# EasyEDA Pro project MK_IR_I2C.epro

# Schematic MK_IR_I2C

## Sheets
1 P1: Board Name: IR_MUX; Create Date: 2025-06-09; Page Name: P1; Project Name: New-Car; Schematic Name: Schematic2; Update Date: 2025-06-10; Company: monkey-cat.com; Drawn: MonkeyCat; Page Size: A4; Part Number: JLCPCB-002; Reviewed: MonkeyCat; Version: V0.1.0
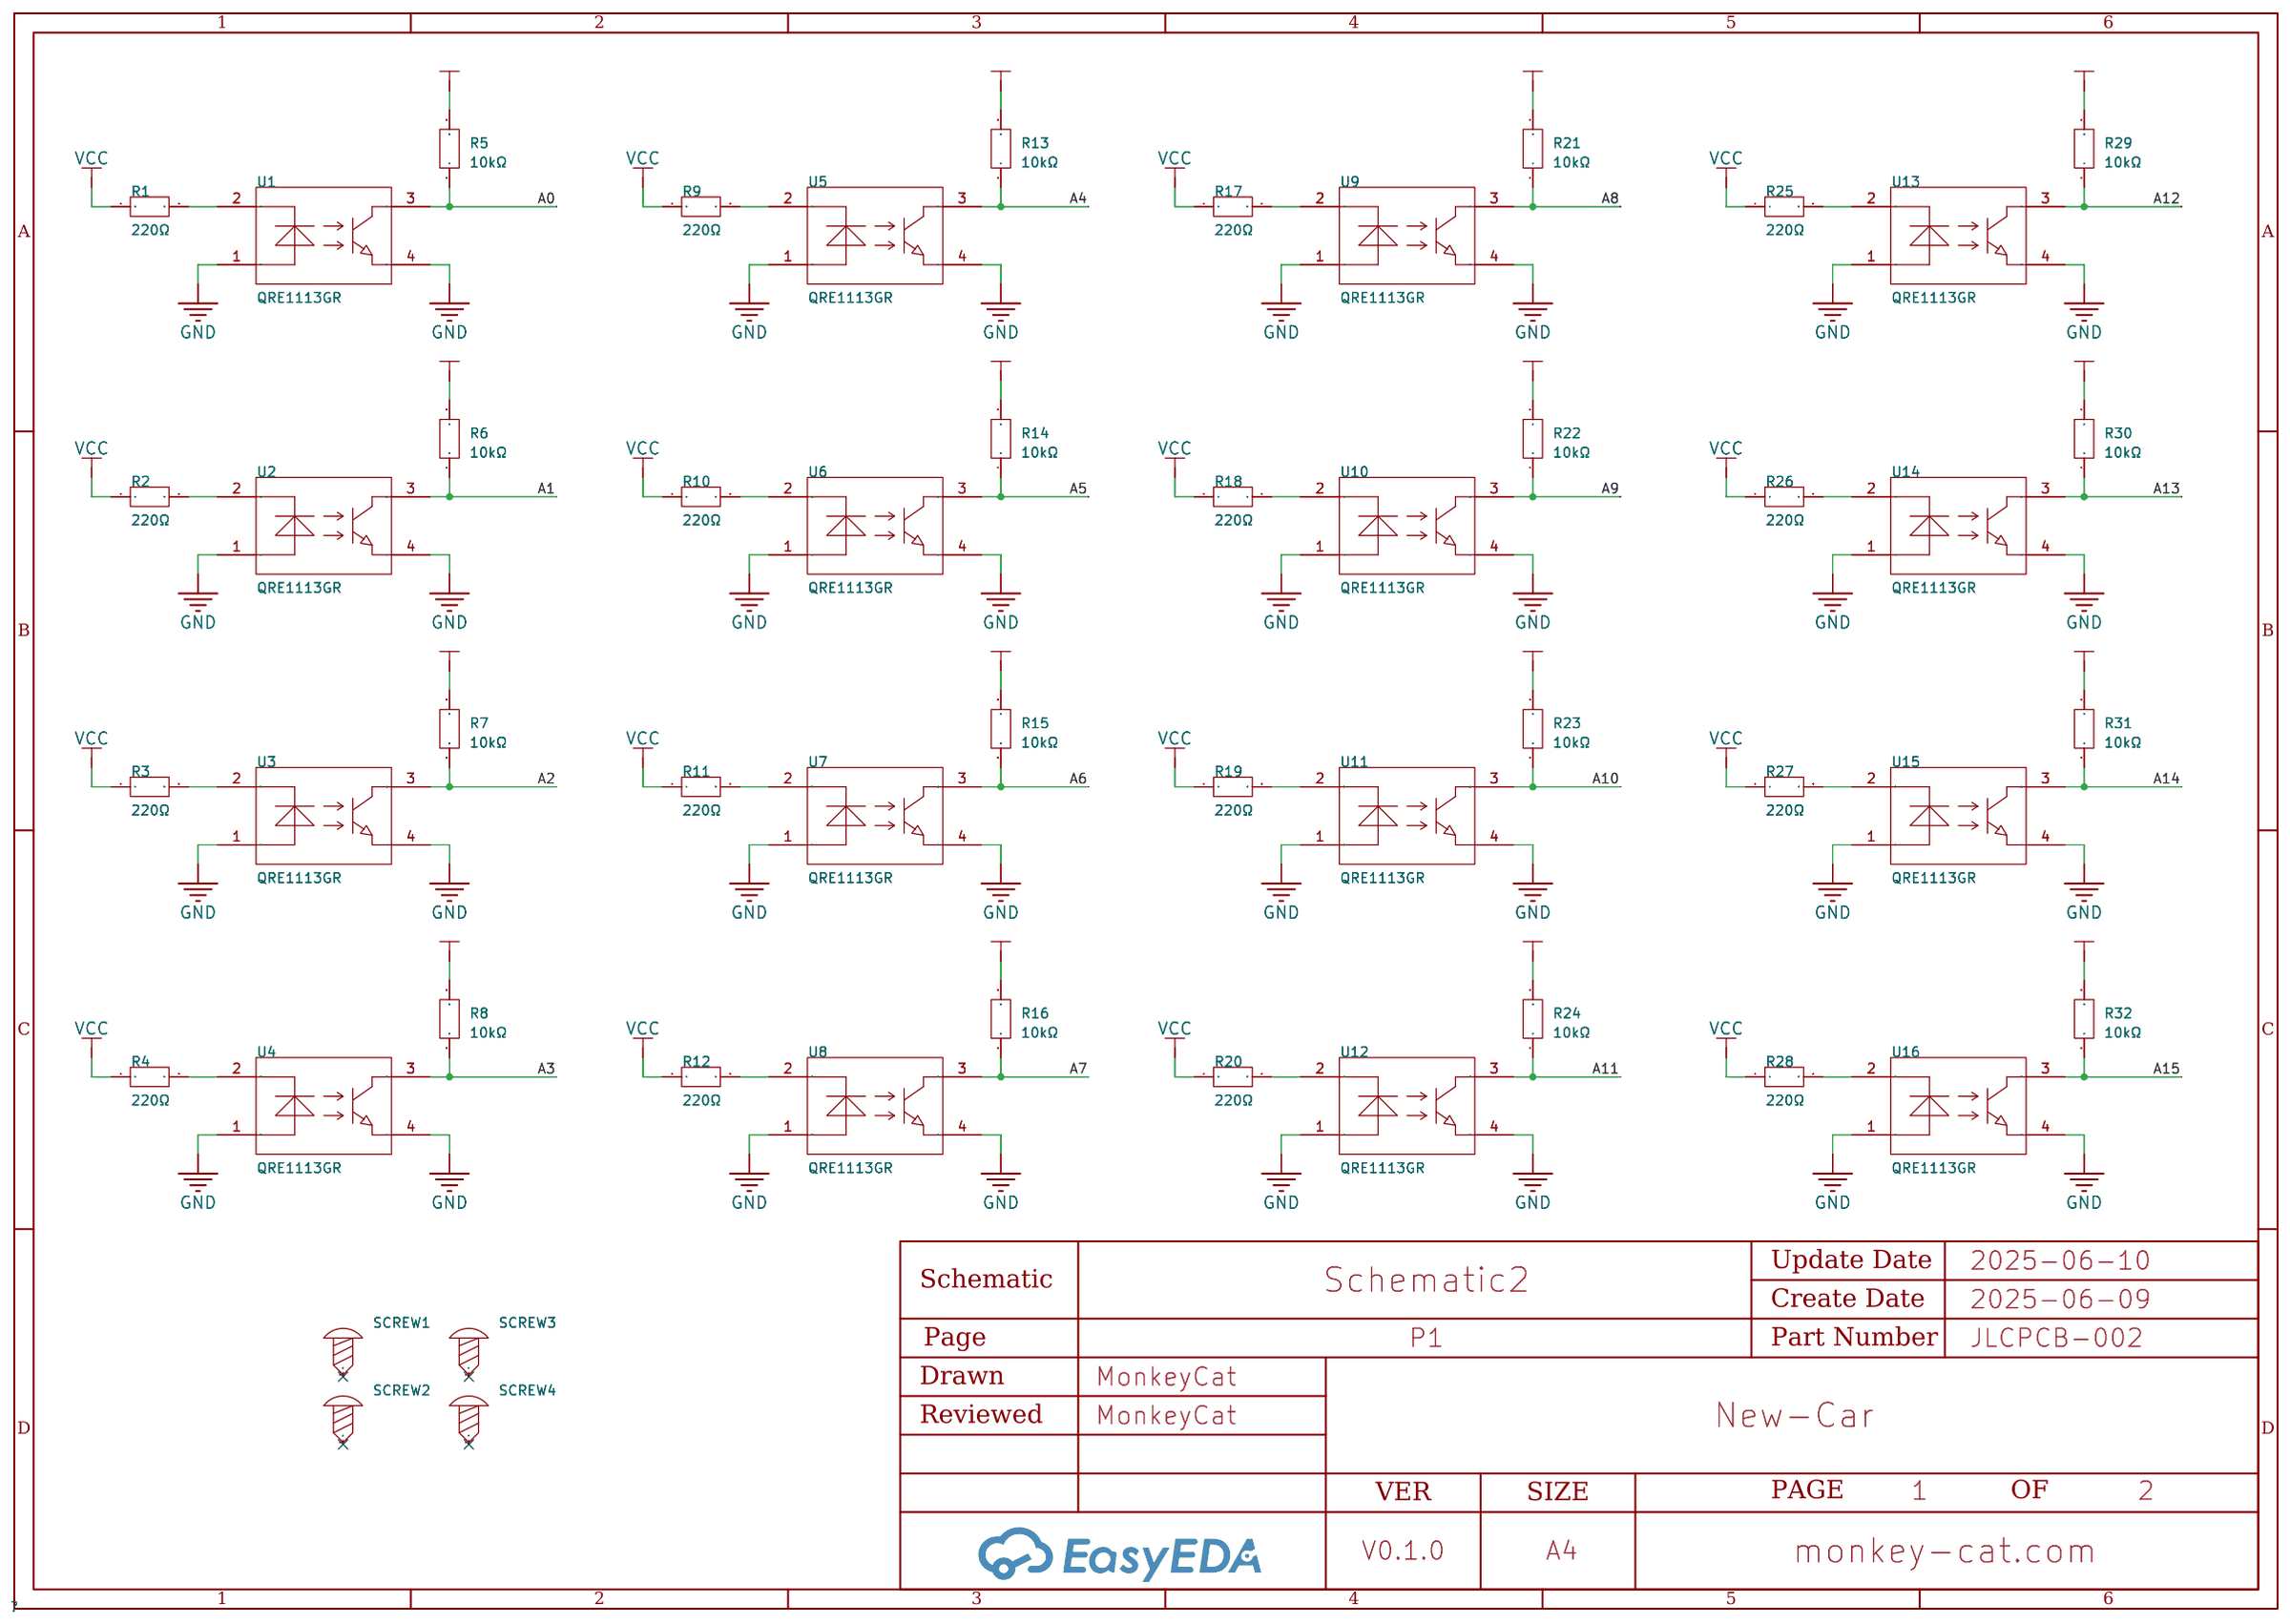
[diagram p0: P1]
2 P2: Board Name: MK_IR_I2C; Page Name: P2; Schematic Name: MK_IR_I2C; Update Date: 2025-06-11
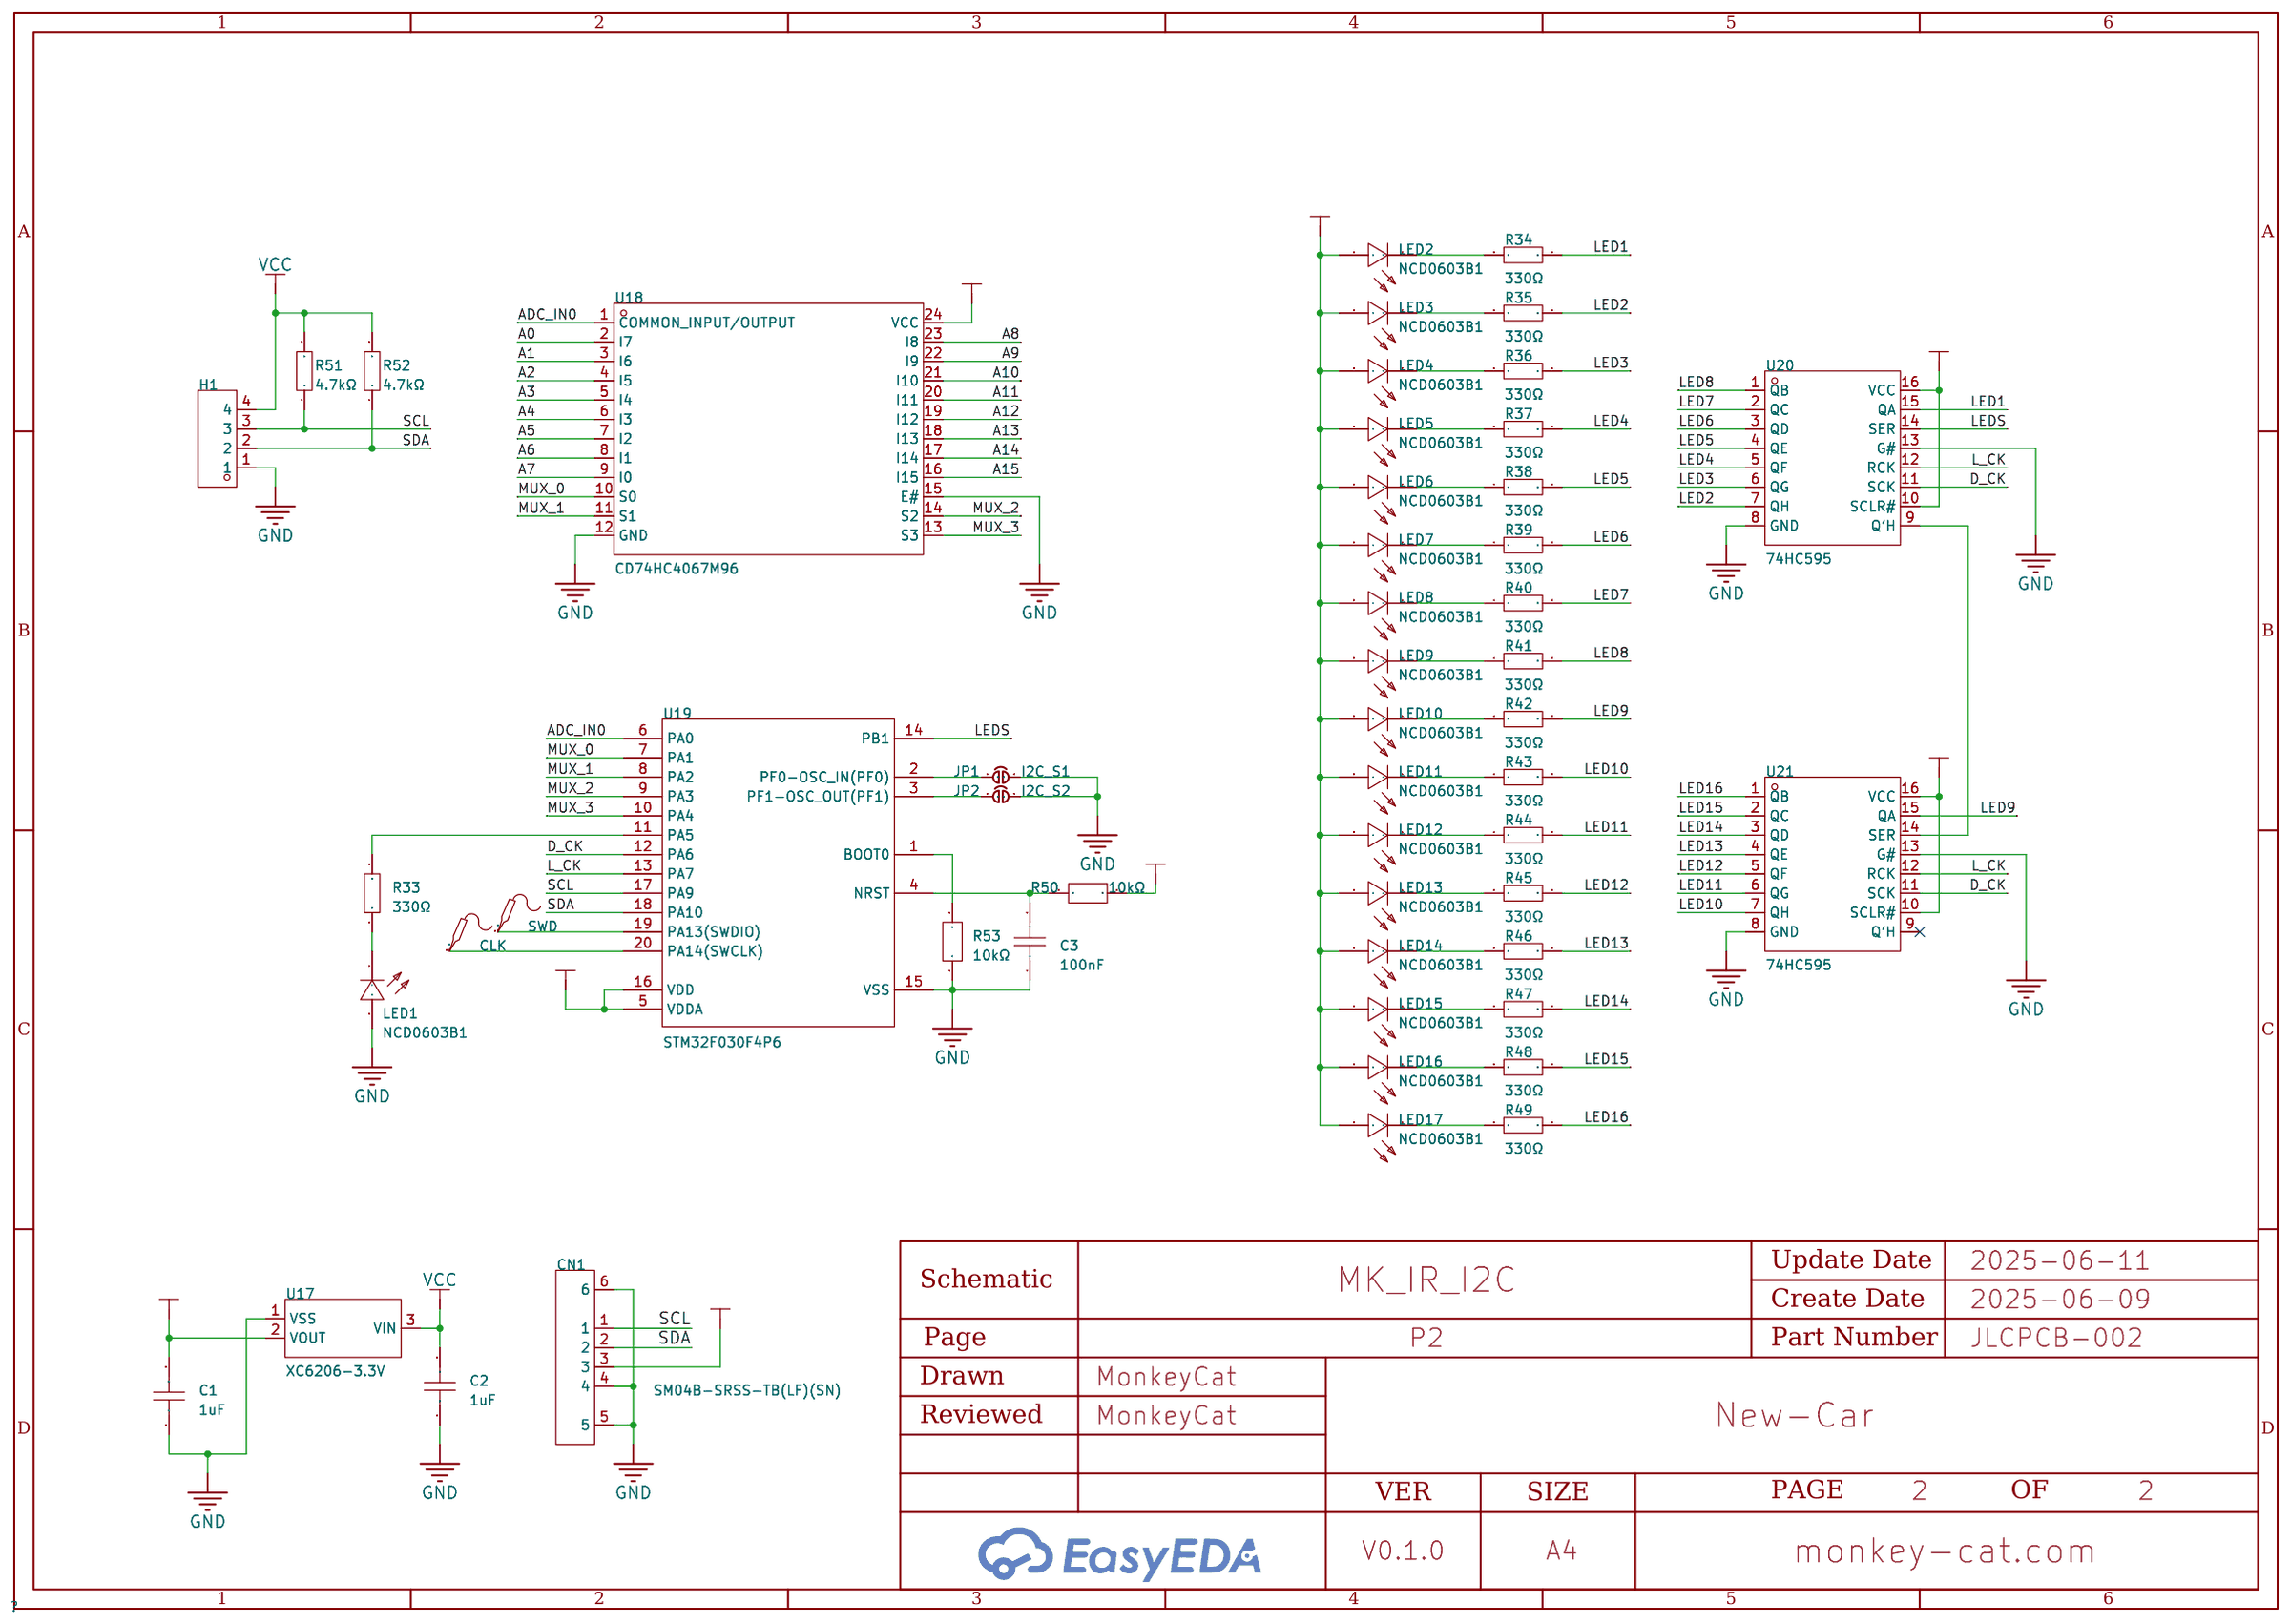
[diagram p1: P2]

## Parts
sheet P1
R1  220Ω  [R0603]
R2  220Ω  [R0603]
R3  220Ω  [R0603]
R4  220Ω  [R0603]
R5  10kΩ  [R0603]
R6  10kΩ  [R0603]
R7  10kΩ  [R0603]
R8  10kΩ  [R0603]
R9  220Ω  [R0603]
R10  220Ω  [R0603]
R11  220Ω  [R0603]
R12  220Ω  [R0603]
R13  10kΩ  [R0603]
R14  10kΩ  [R0603]
R15  10kΩ  [R0603]
R16  10kΩ  [R0603]
R17  220Ω  [R0603]
R18  220Ω  [R0603]
R19  220Ω  [R0603]
R20  220Ω  [R0603]
R21  10kΩ  [R0603]
R22  10kΩ  [R0603]
R23  10kΩ  [R0603]
R24  10kΩ  [R0603]
R25  220Ω  [R0603]
R26  220Ω  [R0603]
R27  220Ω  [R0603]
R28  220Ω  [R0603]
R29  10kΩ  [R0603]
R30  10kΩ  [R0603]
R31  10kΩ  [R0603]
R32  10kΩ  [R0603]
SCREW1  -  [Screw-Hole-M3]
SCREW2  -  [Screw-Hole-M3]
SCREW3  -  [Screw-Hole-M3]
SCREW4  -  [Screw-Hole-M3]
U1  QRE1113GR  [OPTO-SMD_QRE1113GR]
U2  QRE1113GR  [OPTO-SMD_QRE1113GR]
U3  QRE1113GR  [OPTO-SMD_QRE1113GR]
U4  QRE1113GR  [OPTO-SMD_QRE1113GR]
U5  QRE1113GR  [OPTO-SMD_QRE1113GR]
U6  QRE1113GR  [OPTO-SMD_QRE1113GR]
U7  QRE1113GR  [OPTO-SMD_QRE1113GR]
U8  QRE1113GR  [OPTO-SMD_QRE1113GR]
U9  QRE1113GR  [OPTO-SMD_QRE1113GR]
U10  QRE1113GR  [OPTO-SMD_QRE1113GR]
U11  QRE1113GR  [OPTO-SMD_QRE1113GR]
U12  QRE1113GR  [OPTO-SMD_QRE1113GR]
U13  QRE1113GR  [OPTO-SMD_QRE1113GR]
U14  QRE1113GR  [OPTO-SMD_QRE1113GR]
U15  QRE1113GR  [OPTO-SMD_QRE1113GR]
U16  QRE1113GR  [OPTO-SMD_QRE1113GR]
sheet P2
C1  1uF  [C0603]
C2  1uF  [C0603]
C3  100nF  [C0603]
CLK  -  [Test-Point-0.5mm]
CN1  SM04B-SRSS-TB(LF)(SN)  [CONN-SMD_4P-P1.00_SM04B-SRSS-TB-LF-SN]
H1  -  [HDR-TH_4P-P2.54-V-M]
JP1  I2C_S1  [SOLDER JUMPER]
JP2  I2C_S2  [SOLDER JUMPER]
LED1  NCD0603B1  [LED0603-RD]
LED2  NCD0603B1  [LED0603-RD]
LED3  NCD0603B1  [LED0603-RD]
LED4  NCD0603B1  [LED0603-RD]
LED5  NCD0603B1  [LED0603-RD]
LED6  NCD0603B1  [LED0603-RD]
LED7  NCD0603B1  [LED0603-RD]
LED8  NCD0603B1  [LED0603-RD]
LED9  NCD0603B1  [LED0603-RD]
LED10  NCD0603B1  [LED0603-RD]
LED11  NCD0603B1  [LED0603-RD]
LED12  NCD0603B1  [LED0603-RD]
LED13  NCD0603B1  [LED0603-RD]
LED14  NCD0603B1  [LED0603-RD]
LED15  NCD0603B1  [LED0603-RD]
LED16  NCD0603B1  [LED0603-RD]
LED17  NCD0603B1  [LED0603-RD]
R33  330Ω  [R0603]
R34  330Ω  [R0603]
R35  330Ω  [R0603]
R36  330Ω  [R0603]
R37  330Ω  [R0603]
R38  330Ω  [R0603]
R39  330Ω  [R0603]
R40  330Ω  [R0603]
R41  330Ω  [R0603]
R42  330Ω  [R0603]
R43  330Ω  [R0603]
R44  330Ω  [R0603]
R45  330Ω  [R0603]
R46  330Ω  [R0603]
R47  330Ω  [R0603]
R48  330Ω  [R0603]
R49  330Ω  [R0603]
R50  10kΩ  [R0603]
R51  4.7kΩ  [R0603]
R52  4.7kΩ  [R0603]
R53  10kΩ  [R0603]
SWD  -  [Test-Point-0.5mm]
U17  XC6206-3.3V  [SOT-23-3_L2.9-W1.3-P0.95-LS2.4-BR]
U18  CD74HC4067M96  [SOIC-24_L15.4-W7.5-P1.27-LS10.3-BL]
U19  STM32F030F4P6  [TSSOP-20_L6.5-W4.4-P0.65-LS6.4-BL]
U20  74HC595  [SOP-16_L9.9-W3.9-P1.27-LS6.0-BL]
U21  74HC595  [SOP-16_L9.9-W3.9-P1.27-LS6.0-BL]

## Library data of the parts
R1-R4 R9-R12 R17-R20 R25-R28 = FRC0603F2200TS: Type:Thick Film Resistors Resistance: Tolerance:±1% Tolerance:±1% Power(Watts): Voltage-Supply(Max): Temperature Coefficient:±100ppm/℃ Temperature Coefficient:±100ppm/℃ Operating Temperature:-55℃~+155℃ Operating Temperature:-55℃~+155℃; LCSC Part Name: 220Ω ±1% 100mW 厚膜电阻; Supplier Part: C2907014; Manufacturer: FOJAN(富捷); Supplier Footprint: 0603; JLCPCB Part Class: 扩展库; Datasheet: https://atta.szlcsc.com/upload/public/pdf/source/20211221/925EC7D7225764EE0046F22065062C87.pdf; Supplier: LCSC; Type: Thick Film Resistors; Tolerance: ±1%; Temperature Coefficient: ±100ppm/℃; Operating Temperature: -55℃~+155℃
R5-R8 R13-R16 R21-R24 R29-R32 R50 R53 = FRC0603J103 TS: Type:Thick Film Resistors Resistance:10kΩ Tolerance:±5% Tolerance:±5% Power(Watts):0.1W Voltage-Supply(Max):75V Temperature Coefficient:±100ppm/℃ Temperature Coefficient:±100ppm/℃ Operating Temperature:-55℃~+155℃ Operating Temperature:-55℃~+155℃; LCSC Part Name: 10kΩ ±5% 100mW 厚膜电阻; Supplier Part: C2930027; Manufacturer: FOJAN(富捷); Supplier Footprint: 0603; JLCPCB Part Class: 扩展库; Datasheet: https://atta.szlcsc.com/upload/public/pdf/source/20211221/925EC7D7225764EE0046F22065062C87.pdf; Supplier: LCSC; Type: Thick Film Resistors; Tolerance: ±5%; Power(Watts): 0.1W; Voltage-Supply(Max): 75V; Temperature Coefficient: ±100ppm/℃; Operating Temperature: -55℃~+155℃
SCREW1-SCREW4 = Screw-Hole-M3: Supplier Footprint: 插件
U1-U16 = QRE1113GR: Sensing Distance:1mm Collector Current (Max):20mA; Supplier Part: C232862; Manufacturer: onsemi(安森美); Supplier Footprint: SMD-4P; JLCPCB Part Class: 扩展库; Datasheet: https://atta.szlcsc.com/upload/public/pdf/source/20221020/4EA8EB874547A092CF9AAECC2DF94CC1.pdf; Supplier: LCSC; Sensing Distance: 1mm; Collector Current (Max): 20mA; Check: false
C1 C2 = CL10A105KB8NNNC: Capacitance: Tolerance:±10% Tolerance:±10% Voltage Rated: Temperature Coefficient:; LCSC Part Name: 1uF ±10% 50V; Supplier Part: C15849; Manufacturer: SAMSUNG(三星); Supplier Footprint: 0603; JLCPCB Part Class: 基础库; Datasheet: https://atta.szlcsc.com/upload/public/pdf/source/20160218/1457707763339.pdf; Supplier: LCSC; Tolerance: ±10%
C3 = CC0603KRX7R9BB104: Capacitance: Tolerance:±10% Tolerance:±10% Voltage Rated: Temperature Coefficient:; LCSC Part Name: 100nF ±10% 50V; Supplier Part: C14663; Manufacturer: YAGEO(国巨); Supplier Footprint: 0603; JLCPCB Part Class: 基础库; Datasheet: https://atta.szlcsc.com/upload/public/pdf/source/20180910/C282072_33301C7F631E79921B82A8DAC6BCC5B3.pdf; Supplier: LCSC; Tolerance: ±10%
CLK SWD = Test-Point: Test Point 测试点
CN1 = SM04B-SRSS-TB(LF)(SN): Pins Structure:1x4P Pitch:1mm Mounting Style:卧贴 Reference Series:SH Number of Pins:4P Number of Rows:1 Number of PINs Per Row:4 Row Spacing:- Current Rating (Max):1A Contact Material:Copper Alloy Contact Plating:Tin Operating Temperature Range:-25℃~+85℃ O; LCSC Part Name: 1x4P 间距:1mm 卧贴 系列:SH; Supplier Part: C160404; Manufacturer: JST; Supplier Footprint: SMD,P=1mm,卧贴; JLCPCB Part Class: 扩展库; Datasheet: https://atta.szlcsc.com/upload/public/pdf/source/20181010/C265335_7D2AD766CA0E20E745663C87507A223E.pdf; Supplier: LCSC; Pins Structure: 1x4P; Pitch: 1mm; Mounting Style: 卧贴; Reference Series: SH; Number of Pins: 4P; Number of Rows: 1; Number of PINs Per Row: 4; Current Rating (Max): 1A; Contact Material: Copper Alloy; Contact Plating: Tin; Operating Temperature Range: -25℃~+85℃; Rated Voltage (Max): 50V; Plastic Material: PA; Flame Retardant Rating: UL94V-0; Supplementary Features: 辅助焊脚; Colour: White; Z-Height of the Board: 2.9mm; X-Length of Bottom Edge on Board (Spacing Line): 6mm; Y-Width of Bottom Edge on Board: 4.32mm
H1 = HDR-M_2.54_1x4P: Supplier Footprint: Through
JP1 JP2 = Solder Jumper: Manufacturer: N/A; Manufacturer Part: N/A; Supplier: Steve Manley; Supplier Part: N/A; link: N/A
LED1-LED17 = NCD0603B1: Lamp Holder Type:- Illumination Color:- Voltage - Forward(Vf):2.6V~3.6V Voltage - Forward(Vf):2.6V~3.6V Power(Watts):72mW Forward Current:10mA Wavelength - Dominant:463nm~475nm Wavelength - Dominant:463nm~475nm Peak Wavelength:- Diode Configuration:- Lens; Supplier Part: C84266; Manufacturer: 国星光电; Supplier Footprint: 0603; JLCPCB Part Class: 扩展库; Datasheet: https://atta.szlcsc.com/upload/public/pdf/source/20200820/C84266_6A3CDBEFA72C6CAD68EDA53474ADAE6C.pdf; Supplier: LCSC; Voltage - Forward(Vf): 2.6V~3.6V; Power(Watts): 72mW; Forward Current: 10mA; Wavelength - Dominant: 463nm~475nm; Luminous Intensity: 80mcd~220mcd; Viewing Angle: 130°; Operating Temperature: -30℃~+85℃
R33-R49 = 0603WAF3300T5E: Type:Thick Film Resistors Resistance: Tolerance:±1% Tolerance:±1% Power(Watts): Overload Voltage (Max): Temperature Coefficient:±100ppm/℃ Temperature Coefficient:±100ppm/℃ Operating Temperature Range:-55℃~+155℃ Operating Temperature Range:-55℃~+155℃; LCSC Part Name: 330Ω ±1% 100mW 厚膜电阻; Supplier Part: C23138; Manufacturer: UNI-ROYAL(厚声); Supplier Footprint: 0603; JLCPCB Part Class: 基础库; Datasheet: https://atta.szlcsc.com/upload/public/pdf/source/20200306/C422600_1E6D84923E4A46A82E41ADD87F860B5C.pdf; Supplier: LCSC; Type: Thick Film Resistors; Tolerance: ±1%; Temperature Coefficient: ±100ppm/℃; Operating Temperature Range: -55℃~+155℃
R51 R52 = RC0603FR-074K7L: Type:Thick Film Resistors Resistance: Tolerance:±1% Tolerance:±1% Power(Watts): Overload Voltage (Max): Temperature Coefficient:±100ppm/℃ Temperature Coefficient:±100ppm/℃ Operating Temperature Range:-55℃~+155℃ Operating Temperature Range:-55℃~+155℃; LCSC Part Name: 厚膜电阻 4.7kΩ ±1% 100mW; Supplier Part: C99782; Manufacturer: YAGEO(国巨); Supplier Footprint: 0603; JLCPCB Part Class: 扩展库; Datasheet: https://atta.szlcsc.com/upload/public/pdf/source/20180224/C181757_15194369480721363983.pdf; Supplier: LCSC; Type: Thick Film Resistors; Tolerance: ±1%; Temperature Coefficient: ±100ppm/℃; Operating Temperature Range: -55℃~+155℃
U17 = XC6206-3.3V: Output Type:Fixed Voltage - Supply:6V Output Voltage:3.3V Output Voltage:3.3V Output Current:250mA Voltage Dropout:- standby current:- Features:Short-Circuit  Protection；Low ESR；Overcurrent Protection Operating Temperature:-40℃~+85℃@(Tj) Operating Tempera; LCSC Part Name: 输入6V 输出3.3V 250mA; Supplier Part: C3015484; Manufacturer: YONGYUTAI(永裕泰); Supplier Footprint: SOT-23; JLCPCB Part Class: 扩展库; Datasheet: https://atta.szlcsc.com/upload/public/pdf/source/20220516/96806819DEDB4F91BFC22B730F045FD3.pdf; Supplier: LCSC; Output Type: Fixed; Voltage - Supply: 6V; Output Voltage: 3.3V; Output Current: 250mA; Features: Short-Circuit  Protection；Low ESR；Overcurrent Protection; Operating Temperature: -40℃~+85℃@(Tj); Output Configuration: Positive electrode; Number of Outputs: 1
U18 = CD74HC4067M96: Switch Circuit:- Number of Channels:- Voltage - Supply:2V~6V Voltage - Supply:2V~6V Turn-on time:83ns RDS(on):200Ω Turn-off time:83ns Operating Temperature:-55℃~+125℃ Operating Temperature:-55℃~+125℃; LCSC Part Name: 高速CMOS逻辑16通道模拟多路复用器/解复用器; Supplier Part: C496123; Manufacturer: TI(德州仪器); Supplier Footprint: SOIC-24-300mil; JLCPCB Part Class: 扩展库; Datasheet: https://www.ti.com/cn/lit/gpn/cd74hc4067; Supplier: LCSC; Voltage - Supply: 2V~6V; Turn-on time: 83ns; RDS(on): 200Ω; Turn-off time: 83ns; Operating Temperature: -55℃~+125℃
U19 = STM32F030F4P6: CPU Core:ARM-M0 CPU Maximum Speed:48MHz Program Storage Size:16KB Program Memory Type:FLASH Number of I/O:15 ADC (Bit):12bit Voltage - Supply:2.4V~3.6V Voltage - Supply:2.4V~3.6V Applications:-; LCSC Part Name: 主流ARM Cortex-M0超值系列MCU，具有16 KB Flash和48 MHz CPU; Supplier Part: C32908; Manufacturer: ST(意法半导体); Supplier Footprint: TSSOP-20; JLCPCB Part Class: 扩展库; Datasheet: https://atta.szlcsc.com/upload/public/pdf/source/20150124/1457707258011.pdf; Supplier: LCSC; CPU Core: ARM-M0; CPU Maximum Speed: 48MHz; Program Storage Size: 16KB; Program Memory Type: FLASH; Number of I/O: 15; ADC (Bit): 12bit; Voltage - Supply: 2.4V~3.6V
U20 U21 = 74HC595: Function:串行至串行或并行 Supply Voltage:2V~6V Supply Voltage:2V~6V Number of Elements:1 Number of Bits per Element:8 Output Type:Tri-State Series: Operating Temperature:-40℃~+85℃ Operating Temperature:-40℃~+85℃; Supplier Part: C18164493; Manufacturer: GR(国睿); Supplier Footprint: SOP-16; JLCPCB Part Class: 扩展库; Datasheet: https://atta.szlcsc.com/upload/public/pdf/source/20230915/F264A7C02E418D1689E15579DAA93EB8.pdf; Supplier: LCSC; Function: 串行至串行或并行; Supply Voltage: 2V~6V; Number of Elements: 1; Number of Bits per Element: 8; Output Type: Tri-State; Operating Temperature: -40℃~+85℃

## Nets
+3V3: C1.2 LED2.2(+) LED3.2(+) LED4.2(+) LED5.2(+) LED6.2(+) LED7.2(+) LED8.2(+) LED9.2(+) LED10.2(+) LED11.2(+) LED12.2(+) LED13.2(+) LED14.2(+) LED15.2(+) LED16.2(+) LED17.2(+) R5.2 R6.2 R7.2 R8.2 R13.2 R14.2 R15.2 R16.2 R21.2 R22.2 R23.2 R24.2 R29.2 R30.2 R31.2 R32.2 R50.2 U17.2(VOUT) U18.24(VCC) U19.5(VDDA) U19.16(VDD) U20.10(SCLR#) U20.16(VCC) U21.10(SCLR#) U21.16(VCC)
GND: C1.1 C2.1 C3.1 CN1.4 CN1.5 CN1.6 H1.1 JP1.2 JP2.2 LED1.2(+) R53.1 U1.1 U1.4 U2.1 U2.4 U3.1 U3.4 U4.1 U4.4 U5.1 U5.4 U6.1 U6.4 U7.1 U7.4 U8.1 U8.4 U9.1 U9.4 U10.1 U10.4 U11.1 U11.4 U12.1 U12.4 U13.1 U13.4 U14.1 U14.4 U15.1 U15.4 U16.1 U16.4 U17.1(VSS) U18.12(GND) U18.15(E#) U19.15(VSS) U20.8(GND) U20.13(G#) U21.8(GND) U21.13(G#)
VCC: C2.2 CN1.3 H1.4 R1.1 R2.1 R3.1 R4.1 R9.1 R10.1 R11.1 R12.1 R17.1 R18.1 R19.1 R20.1 R25.1 R26.1 R27.1 R28.1 R51.2 R52.2 U17.3(VIN)
A0: R5.1 U1.3 U18.2(I7)
A1: R6.1 U2.3 U18.3(I6)
A2: R7.1 U3.3 U18.4(I5)
A3: R8.1 U4.3 U18.5(I4)
A4: R13.1 U5.3 U18.6(I3)
A5: R14.1 U6.3 U18.7(I2)
A6: R15.1 U7.3 U18.8(I1)
A7: R16.1 U8.3 U18.9(I0)
A8: R21.1 U9.3 U18.23(I8)
A9: R22.1 U10.3 U18.22(I9)
A10: R23.1 U11.3 U18.21(I10)
A11: R24.1 U12.3 U18.20(I11)
A12: R29.1 U13.3 U18.19(I12)
A13: R30.1 U14.3 U18.18(I13)
A14: R31.1 U15.3 U18.17(I14)
A15: R32.1 U16.3 U18.16(I15)
ADC_IN0: U18.1(COMMON INPUT/OUTPUT) U19.6(PA0)
D_CK: U19.12(PA6) U20.11(SCK) U21.11(SCK)
L_CK: U19.13(PA7) U20.12(RCK) U21.12(RCK)
LED1: R34.2 U20.15(QA)
LED2: R35.2 U20.7(QH)
LED3: R36.2 U20.6(QG)
LED4: R37.2 U20.5(QF)
LED5: R38.2 U20.4(QE)
LED6: R39.2 U20.3(QD)
LED7: R40.2 U20.2(QC)
LED8: R41.2 U20.1(QB)
LED9: R42.2 U21.15(QA)
LED10: R43.2 U21.7(QH)
LED11: R44.2 U21.6(QG)
LED12: R45.2 U21.5(QF)
LED13: R46.2 U21.4(QE)
LED14: R47.2 U21.3(QD)
LED15: R48.1 U21.2(QC)
LED16: R49.2 U21.1(QB)
LEDS: U19.14(PB1) U20.14(SER)
MUX_0: U18.10(S0) U19.7(PA1)
MUX_1: U18.11(S1) U19.8(PA2)
MUX_2: U18.14(S2) U19.9(PA3)
MUX_3: U18.13(S3) U19.10(PA4)
SCL: CN1.1 H1.3 R51.1 U19.17(PA9)
SDA: CN1.2 H1.2 R52.1 U19.18(PA10)
$1N608: R1.2 U1.2
$1N2685: R2.2 U2.2
$1N2871: R3.2 U3.2
$1N3057: R4.2 U4.2
$1N3755: R10.2 U6.2
$1N3774: R11.2 U7.2
$1N3775: R9.2 U5.2
$1N3782: R12.2 U8.2
$1N5185: R25.2 U13.2
$1N5188: R26.2 U14.2
$1N5208: R28.2 U16.2
$1N5210: R27.2 U15.2
$1N5219: R18.2 U10.2
$1N5238: R19.2 U11.2
$1N5239: R17.2 U9.2
$1N5244: R20.2 U12.2
$2N3092: U20.9(Q′H) U21.14(SER)
$2N3378: LED1.1(-) R33.1
$2N3386: R33.2 U19.11(PA5)
$2N3948: JP1.1 U19.2(PF0-OSC_IN(PF0))
$2N3976: JP2.1 U19.3(PF1-OSC_OUT(PF1))
$2N7229: C3.2 R50.1 U19.4(NRST)
$2N8629: SWD.1 U19.19(PA13(SWDIO))
$2N8633: CLK.1 U19.20(PA14(SWCLK))
$2N11480: LED6.1(-) R38.1
$2N11482: LED3.1(-) R35.1
$2N11483: LED8.1(-) R40.1
$2N11484: LED7.1(-) R39.1
$2N11485: LED10.1(-) R42.1
$2N11486: LED11.1(-) R43.1
$2N11487: LED9.1(-) R41.1
$2N11490: LED12.1(-) R44.1
$2N11491: LED13.1(-) R45.1
$2N11503: LED14.1(-) R46.1
$2N11504: LED15.1(-) R47.1
$2N11507: LED4.1(-) R36.1
$2N11508: LED2.1(-) R34.1
$2N11509: LED5.1(-) R37.1
$2N13226: LED16.1(-) R48.2
$2N13360: LED17.1(-) R49.1
$2N18356: R53.2 U19.1(BOOT0)

Not connected (* = marked no-connect by the designer): SCREW1 1*; SCREW2 1*; SCREW3 1*; SCREW4 1*; U21 9(Q′H)*

# Board MK_IR_I2C
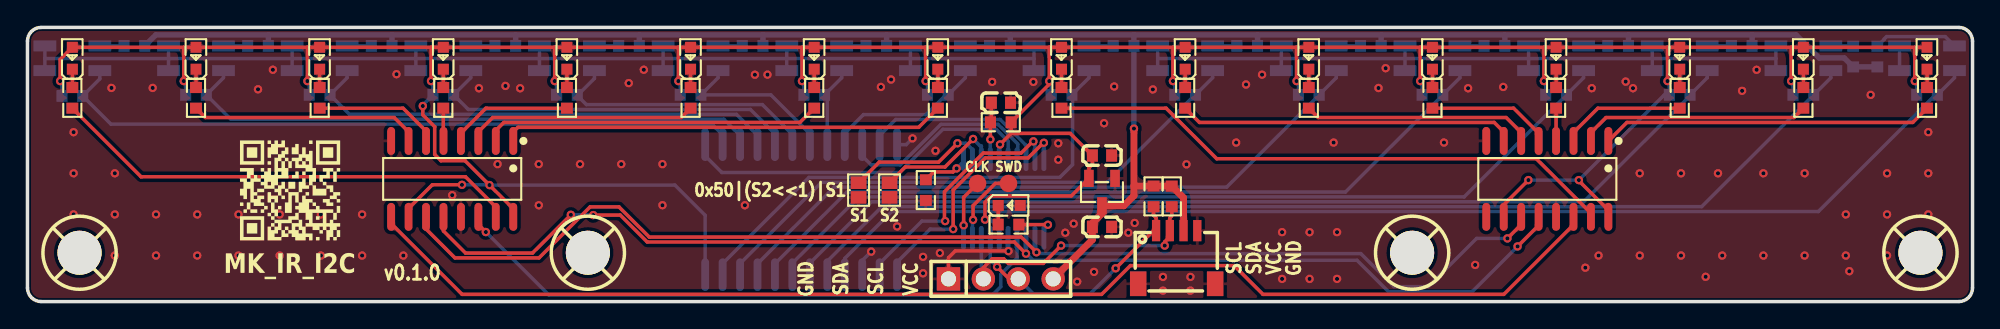
[diagram p2: board, top side]
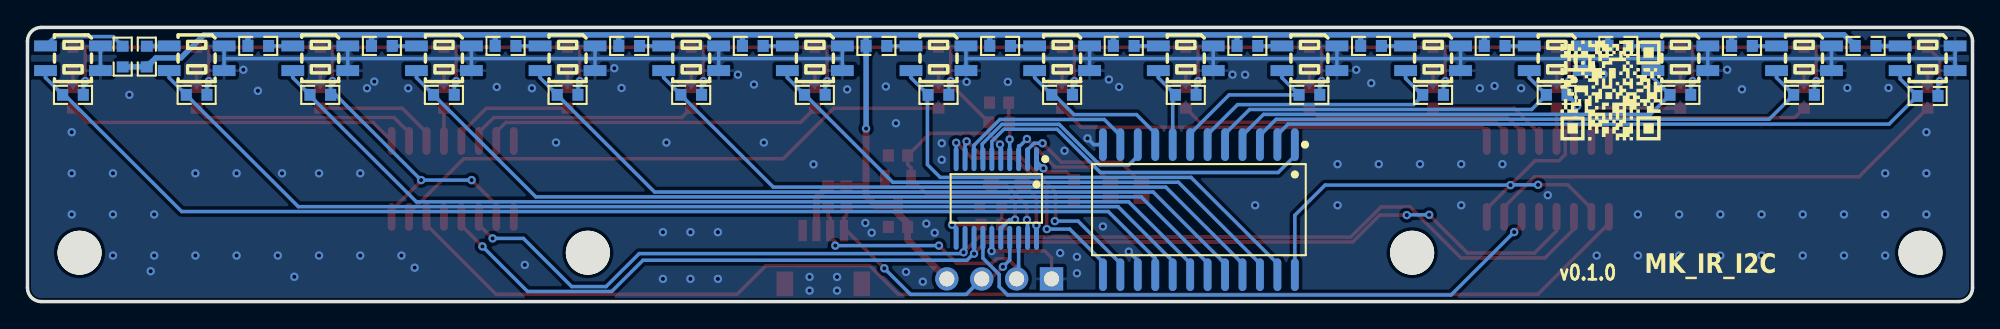
[diagram p3: board, bottom side, seen from below]

Outline 141.58 x 20 mm; copper layers: Top Layer, Bottom Layer. Coordinates in mm from the lower left corner of the outline.
Outline path: 0,19 0,1 arc(0.29,0.29) 1,0 140.58,0 arc(141.29,0.29) 141.58,1 141.58,19 arc(141.29,19.71) 140.58,20 1,20 arc(0.29,19.71) 0,19
Stack: Top Layer 0.035mm / Dielectric1 1.51mm FR4 er 4.5 / Bottom Layer 0.035mm

## Design rules (mm)
template: JLCPCB Capability(Two Layers Board)
spacing copperThickness1oz (default): track to track 0.102, other pairs 0.152 to 0.3
spacing copperThickness2oz: track to track 0.203, other pairs 0.152 to 0.3
track width copperThickness1oz (default): min 0.127, default 0.254, max 2.54
track width copperThickness2oz: min 0.203, default 0.254, max 2.54
differential pair differentialPair (default): width min 0.127, default 0.254, max 2.54; gap min 0.152, default 0.152
via viaSize (default): diameter min 0.5, default 0.61, max 10; hole min 0.3, default 0.305, max 6.3

## Placement (name value [footprint] x y rotation side)
C1  1uF  [C0603]  78.21 10.66 180 top
C2  1uF  [C0603]  78.21 5.45 180 top
C3  100nF  [C0603]  70.86 14.51 180 top
CLK  -  [Test-Point-0.5mm]  69.16 8.62 180 top
CN1  SM04B-SRSS-TB(LF)(SN)  [CONN-SMD_4P-P1.00_SM04B-SRSS-TB-LF-SN]  83.65 3.24 0 top
H1  -  [HDR-TH_4P-P2.54-V-M]  70.85 1.66 0 top
JP1  I2C_S1  [SOLDER JUMPER]  60.5 8.13 270 top
JP2  I2C_S2  [SOLDER JUMPER]  62.75 8.14 270 top
LED1  NCD0603B1  [LED0603-RD]  71.46 7.01 0 top
LED2  NCD0603B1  [LED0603-RD]  3.27 17.75 90 top
LED3  NCD0603B1  [LED0603-RD]  12.27 17.75 90 top
LED4  NCD0603B1  [LED0603-RD]  21.27 17.75 90 top
LED5  NCD0603B1  [LED0603-RD]  30.27 17.75 90 top
LED6  NCD0603B1  [LED0603-RD]  39.27 17.75 90 top
LED7  NCD0603B1  [LED0603-RD]  48.27 17.75 90 top
LED8  NCD0603B1  [LED0603-RD]  57.27 17.75 90 top
LED9  NCD0603B1  [LED0603-RD]  66.27 17.75 90 top
LED10  NCD0603B1  [LED0603-RD]  75.27 17.75 90 top
LED11  NCD0603B1  [LED0603-RD]  84.27 17.75 90 top
LED12  NCD0603B1  [LED0603-RD]  93.27 17.75 90 top
LED13  NCD0603B1  [LED0603-RD]  102.27 17.75 90 top
LED14  NCD0603B1  [LED0603-RD]  111.27 17.75 90 top
LED15  NCD0603B1  [LED0603-RD]  120.27 17.75 90 top
LED16  NCD0603B1  [LED0603-RD]  129.27 17.75 90 top
LED17  NCD0603B1  [LED0603-RD]  138.27 17.75 90 top
R1  220Ω  [R0603]  7.78 18.65 180 bottom
R2  220Ω  [R0603]  16.78 18.65 180 bottom
R3  220Ω  [R0603]  25.78 18.65 180 bottom
R4  220Ω  [R0603]  34.78 18.65 180 bottom
R5  10kΩ  [R0603]  3.27 15 180 bottom
R6  10kΩ  [R0603]  12.27 15.08 180 bottom
R7  10kΩ  [R0603]  21.27 15.08 180 bottom
R8  10kΩ  [R0603]  30.27 15.08 180 bottom
R9  220Ω  [R0603]  43.78 18.65 180 bottom
R10  220Ω  [R0603]  52.78 18.65 180 bottom
R11  220Ω  [R0603]  61.78 18.65 180 bottom
R12  220Ω  [R0603]  70.78 18.65 180 bottom
R13  10kΩ  [R0603]  39.27 15.08 180 bottom
R14  10kΩ  [R0603]  48.27 15.08 180 bottom
R15  10kΩ  [R0603]  57.27 15.08 180 bottom
R16  10kΩ  [R0603]  66.27 15.08 180 bottom
R17  220Ω  [R0603]  79.78 18.65 180 bottom
R18  220Ω  [R0603]  88.78 18.65 180 bottom
R19  220Ω  [R0603]  97.78 18.65 180 bottom
R20  220Ω  [R0603]  106.78 18.65 180 bottom
R21  10kΩ  [R0603]  75.27 15.08 180 bottom
R22  10kΩ  [R0603]  84.27 15.08 180 bottom
R23  10kΩ  [R0603]  93.27 15.08 180 bottom
R24  10kΩ  [R0603]  102.27 15.08 180 bottom
R25  220Ω  [R0603]  115.78 18.65 180 bottom
R26  220Ω  [R0603]  124.78 18.65 180 bottom
R27  220Ω  [R0603]  132.89 17.87 90 bottom
R28  220Ω  [R0603]  134.65 17.87 90 bottom
R29  10kΩ  [R0603]  111.27 15.08 180 bottom
R30  10kΩ  [R0603]  120.27 15.08 180 bottom
R31  10kΩ  [R0603]  129.27 15.08 180 bottom
R32  10kΩ  [R0603]  138.27 15.08 180 bottom
R33  330Ω  [R0603]  71.41 5.62 0 top
R34  330Ω  [R0603]  3.27 14.86 270 top
R35  330Ω  [R0603]  12.27 14.86 270 top
R36  330Ω  [R0603]  21.27 14.86 270 top
R37  330Ω  [R0603]  30.27 14.86 270 top
R38  330Ω  [R0603]  39.27 14.86 270 top
R39  330Ω  [R0603]  48.27 14.86 270 top
R40  330Ω  [R0603]  57.27 14.86 270 top
R41  330Ω  [R0603]  66.27 14.86 270 top
R42  330Ω  [R0603]  75.27 14.86 270 top
R43  330Ω  [R0603]  84.27 14.86 270 top
R44  330Ω  [R0603]  93.27 14.86 270 top
R45  330Ω  [R0603]  102.27 14.86 270 top
R46  330Ω  [R0603]  111.27 14.86 270 top
R47  330Ω  [R0603]  120.27 14.86 270 top
R48  330Ω  [R0603]  129.27 14.86 90 top
R49  330Ω  [R0603]  138.27 14.86 270 top
R50  10kΩ  [R0603]  70.85 13.08 0 top
R51  4.7kΩ  [R0603]  81.97 7.67 90 top
R52  4.7kΩ  [R0603]  83.29 7.67 90 top
R53  10kΩ  [R0603]  65.39 8.13 90 top
SCREW1  -  [Screw-Hole-M3]  40.85 3.5 0 top
SCREW2  -  [Screw-Hole-M3]  3.85 3.5 0 top
SCREW3  -  [Screw-Hole-M3]  100.85 3.5 0 top
SCREW4  -  [Screw-Hole-M3]  137.85 3.5 0 top
SWD  -  [Test-Point-0.5mm]  71.41 8.62 180 top
U1  QRE1113GR  [OPTO-SMD_QRE1113GR]  3.27 17.75 0 bottom
U2  QRE1113GR  [OPTO-SMD_QRE1113GR]  12.27 17.75 0 bottom
U3  QRE1113GR  [OPTO-SMD_QRE1113GR]  21.27 17.75 0 bottom
U4  QRE1113GR  [OPTO-SMD_QRE1113GR]  30.27 17.75 0 bottom
U5  QRE1113GR  [OPTO-SMD_QRE1113GR]  39.27 17.75 0 bottom
U6  QRE1113GR  [OPTO-SMD_QRE1113GR]  48.27 17.75 0 bottom
U7  QRE1113GR  [OPTO-SMD_QRE1113GR]  57.27 17.75 0 bottom
U8  QRE1113GR  [OPTO-SMD_QRE1113GR]  66.27 17.75 0 bottom
U9  QRE1113GR  [OPTO-SMD_QRE1113GR]  75.27 17.75 0 bottom
U10  QRE1113GR  [OPTO-SMD_QRE1113GR]  84.27 17.75 0 bottom
U11  QRE1113GR  [OPTO-SMD_QRE1113GR]  93.27 17.75 0 bottom
U12  QRE1113GR  [OPTO-SMD_QRE1113GR]  102.27 17.75 0 bottom
U13  QRE1113GR  [OPTO-SMD_QRE1113GR]  111.27 17.75 0 bottom
U14  QRE1113GR  [OPTO-SMD_QRE1113GR]  120.27 17.75 0 bottom
U15  QRE1113GR  [OPTO-SMD_QRE1113GR]  129.27 17.75 0 bottom
U16  QRE1113GR  [OPTO-SMD_QRE1113GR]  138.27 17.75 0 bottom
U17  XC6206-3.3V  [SOT-23-3_L2.9-W1.3-P0.95-LS2.4-BR]  78.21 7.99 90 top
U18  CD74HC4067M96  [SOIC-24_L15.4-W7.5-P1.27-LS10.3-BL]  56.31 6.7 0 bottom
U19  STM32F030F4P6  [TSSOP-20_L6.5-W4.4-P0.65-LS6.4-BL]  71.06 7.52 0 bottom
U20  74HC595  [SOP-16_L9.9-W3.9-P1.27-LS6.0-BL]  30.92 8.95 180 top
U21  74HC595  [SOP-16_L9.9-W3.9-P1.27-LS6.0-BL]  110.63 8.95 180 top

## Footprints (pads in the part's own frame, mm; a bottom-side part is the same pattern mirrored in y, then rotated)
C0603
  rect 0.8x0.9 smd: 1(-0.7,0) 2(0.7,0)
CONN-SMD_4P-P1.00_SM04B-SRSS-TB-LF-SN
  rect 0.6x1.55 smd: 1(-1.5,1.938) 2(-0.5,1.938) 3(0.5,1.938) 4(1.5,1.938)
  rect 1.2x1.8 smd: 5(2.8,-1.938) 6(-2.8,-1.938)
HDR-TH_4P-P2.54-V-M
  rect 1.7x1.7 hole 1.1: 1(-3.81,0)
  round 1.7 hole 1.1: 2(-1.27,0) 3(1.27,0) 4(3.81,0)
LED0603-RD
  rect 0.8x0.8 smd: 1(-0.799,0) 2(0.799,0)
OPTO-SMD_QRE1113GR
  rect 1.66x0.8 smd: 1(-2,-0.9) 2(2,-0.9) 3(2,0.9) 4(-2,0.9)
R0603
  rect 0.806x0.864 smd: 1(-0.753,0) 2(0.753,0)
Screw-Hole-M3
  round 3.2 hole 3.2: 1(-0.064,0.064)
SOIC-24_L15.4-W7.5-P1.27-LS10.3-BL
  oval 0.574x2.388 smd: 1(-6.985,-4.744) 2(-5.715,-4.744) 3(-4.445,-4.744) 4(-3.175,-4.744) 5(-1.905,-4.744) 6(-0.635,-4.744) 7(0.635,-4.744) 8(1.905,-4.744) 9(3.175,-4.744) 10(4.445,-4.744) 11(5.715,-4.744) 12(6.985,-4.744) 13(6.985,4.744) 14(5.715,4.744) 15(4.445,4.744) 16(3.175,4.744) 17(1.905,4.744) 18(0.635,4.744) 19(-0.635,4.744) 20(-1.905,4.744) 21(-3.175,4.744) 22(-4.445,4.744) 23(-5.715,4.744) 24(-6.985,4.744)
SOLDER JUMPER
  rect 0.914x1.143 smd: 1(-0.533,0) 2(0.533,0)
SOP-16_L9.9-W3.9-P1.27-LS6.0-BL
  oval 0.574x2.038 smd: 1(-4.445,-2.769) 2(-3.175,-2.769) 3(-1.905,-2.769) 4(-0.635,-2.769) 5(0.635,-2.769) 6(1.905,-2.769) 7(3.175,-2.769) 8(4.445,-2.769) 9(4.445,2.769) 10(3.175,2.769) 11(1.905,2.769) 12(0.635,2.769) 13(-0.635,2.769) 14(-1.905,2.769) 15(-3.175,2.769) 16(-4.445,2.769)
SOT-23-3_L2.9-W1.3-P0.95-LS2.4-BR
  rect 1.25x0.7 smd: 1(1,-0.95) 2(1,0.95) 3(-1,0)
Test-Point-0.5mm
  round 1.27 smd: 1(0,0)
TSSOP-20_L6.5-W4.4-P0.65-LS6.4-BL
  oval 0.364x1.742 smd: 1(-2.925,-2.871) 2(-2.275,-2.871) 3(-1.625,-2.871) 4(-0.975,-2.871) 5(-0.325,-2.871) 6(0.325,-2.871) 7(0.975,-2.871) 8(1.625,-2.871) 9(2.275,-2.871) 10(2.925,-2.871) 11(2.925,2.871) 12(2.275,2.871) 13(1.625,2.871) 14(0.975,2.871) 15(0.325,2.871) 16(-0.325,2.871) 17(-0.975,2.871) 18(-1.625,2.871) 19(-2.275,2.871) 20(-2.925,2.871)

## Nets
As in the schematic.

Pads without a net: SCREW1 1; SCREW2 1; SCREW3 1; SCREW4 1; U21 9

## Via types
v1: diameter 0.61, hole 0.305, Top Layer to Bottom Layer, 158 vias

## Routing (per net, layer and track width the routed paths; a pad name or vN(x,y) marks a point on that pad's centre or on a via; arc(x,y) is an arc through that point)
+3V3: length 281
  Top Layer w0.254: 92.37,18.55 LED11.2 83.38,18.55 ; 92.37,18.55 LED12.2 101.38,18.55 ; 92.37,18.55 v1(92.37,16.09) ; 74.37,18.55 LED9.2 65.38,18.55 ; 74.37,18.55 LED10.2 83.38,18.55 ; 74.37,18.55 v1(74.37,16.09) 74.37,15.85 R50.2 71.6,12.27 ; 47.38,18.55 LED6.2 38.38,18.55 ; 47.38,18.55 LED7.2 56.37,18.55 ; 47.38,18.55 v1(47.38,16.09) ; v1(101.38,16.09) 101.38,18.55 ; 101.38,18.55 LED13.2 110.38,18.55 ; 20.38,18.55 LED3.2 11.37,18.55 ; 20.38,18.55 v1(20.38,16.09) ; 20.38,18.55 LED4.2 29.38,18.55 ; 83.38,18.55 v1(83.38,16.09) ; v1(109.25,8.86) 107.45,7.06 U21.10 ; 119.38,18.55 LED14.2 110.38,18.55 ; 119.38,18.55 LED15.2 128.38,18.55 ; 119.38,18.55 v1(119.38,16.09) ; 29.38,18.55 v1(29.38,16.09) ; 29.38,18.55 LED5.2 38.38,18.55 ; 11.38,18.55 v1(11.38,16.09) ; 11.37,18.55 LED2.2 2.38,17.66 v1(2.38,16.09) ; v1(69.7,5.98) 69.7,7.24 70.16,7.71 75.98,7.71 U17.2 77.26,9.75 77.51,10 C1.2 75.9,12.27 71.6,12.27 ; v1(28.77,14.27) 28.77,13.63 29.64,12.76 29.64,10.73 30.1,10.28 31.85,10.28 v1(33.63,8.5) 35.36,6.77 U20.16 ; 110.38,18.55 v1(110.38,16.09) ; 38.38,18.55 v1(38.38,16.09) ; v1(31.62,8.52) 29.46,8.52 27.74,6.79 U20.10 ; 65.38,18.55 LED8.2 56.37,18.55 ; 65.38,18.55 v1(65.38,16.09) ; U21.16 115.07,6.66 112.92,8.81 v1(112.92,8.86) ; 137.38,18.55 LED17.2 ; 137.38,18.55 v1(137.38,16.09) ; 137.38,18.55 LED16.2 128.38,18.55 ; v1(70.79,11.46) 71.6,12.27 ; v1(56.37,16.09) 56.37,18.55 ; 128.38,18.55 v1(128.38,16.09)
  Bottom Layer w0.254: 11.51,15 11.51,15.95 v1(11.38,16.09) ; v1(56.37,16.09) 56.51,15.95 56.51,15 ; U18.24 49.33,6.29 47.12,8.5 v1(33.63,8.5) 33.61,8.52 v1(31.62,8.52) ; v1(20.38,16.09) 20.51,15.95 20.51,15 ; v1(119.38,16.09) 119.51,15.95 R30.2 119.14,15.08 v1(112.92,8.86) v1(109.25,8.86) ; 74.51,15 74.51,15.95 v1(74.37,16.09) ; v1(28.77,14.27) 28.77,14.34 29.51,15.08 ; v1(92.37,16.09) 92.51,15.95 92.51,15 ; v1(29.38,16.09) 29.51,15.95 29.51,15.08 ; 137.51,15 137.51,15.95 v1(137.38,16.09) ; 29.51,15.08 R8.2 ; v1(70.79,11.46) 70.73,11.4 U19.5 ; 101.51,15 101.51,15.95 v1(101.38,16.09) ; 47.51,15 47.51,15.95 v1(47.38,16.09) ; v1(128.38,16.09) 128.51,15.95 128.51,15 ; v1(38.38,16.09) 38.51,15.95 38.51,15 ; U19.16 70.73,5.34 70.09,5.98 v1(69.7,5.98) ; v1(110.38,16.09) 110.51,15.95 110.51,15 ; 83.51,15 83.51,15.95 v1(83.38,16.09) ; 65.51,15 65.51,15.95 v1(65.38,16.09) ; R5.2 2.51,15.95 v1(2.38,16.09)
GND: length 156.2
  Top Layer w0.254: H1.1 67.04,3.2 67.53,3.7 71.39,3.7 v1(71.41,3.68)
  Bottom Layer w0.254: U11.4 91.27,17.73 ; 91.27,17.73 U11.1 ; 91.27,17.73 100.27,17.73 ; 91.27,17.73 82.27,17.73 ; 109.27,17.73 118.27,17.73 ; 109.27,17.73 U13.1 ; 109.27,17.73 U13.4 ; 109.27,17.73 100.27,17.73 ; 118.27,17.73 127.27,17.73 ; 118.27,17.73 U14.1 ; 118.27,17.73 U14.4 ; v1(61.41,3.64) 60.76,2.99 U18.15 ; 10.27,17.73 19.27,17.73 ; 10.27,17.73 U2.4 ; 10.27,17.73 U2.1 ; 10.27,17.73 1.27,17.73 ; 19.27,17.73 U3.4 ; 19.27,17.73 U3.1 ; 19.27,17.73 28.27,17.73 ; v1(71.41,3.68) 71.38,3.71 U19.15 ; 55.27,17.73 U7.1 ; 55.27,17.73 46.27,17.73 ; 55.27,17.73 64.27,17.73 ; 55.27,17.73 U7.4 ; 46.27,17.73 U6.1 ; 46.27,17.73 37.27,17.73 ; 46.27,17.73 U6.4 ; 73.27,17.73 U9.1 ; 73.27,17.73 U9.4 ; 73.27,17.73 64.27,17.73 ; U10.4 82.27,17.73 ; 82.27,17.73 U10.1 ; U1.4 1.27,17.73 ; 1.27,17.73 U1.1 ; 100.27,17.73 U12.4 ; 100.27,17.73 U12.1 ; 64.27,17.73 U8.1 ; 64.27,17.73 U8.4 ; 127.27,17.73 U15.4 ; 127.27,17.73 U15.1 ; 37.27,17.73 U5.1 ; 37.27,17.73 28.27,17.73 ; 37.27,17.73 U5.4 ; U16.4 U16.1 ; 28.27,17.73 U4.1 ; 28.27,17.73 U4.4 ; U18.12 63.96,11.45 v1(64.42,11.91)
  vias: v1(3.36,12.36) v1(3.36,9.36) v1(3.36,6.36) v1(6.11,15.59) v1(6.36,9.36) v1(6.36,6.36) v1(6.36,3.36) v1(9.11,15.59) v1(9.36,6.36) v1(9.36,3.36) v1(12.36,6.36) v1(12.36,3.36) v1(15.36,6.36) v1(15.36,3.36) v1(16.78,15.48) v1(17.86,16.91) v1(18.36,6.36) v1(18.36,3.36) v1(21.36,6.36) v1(21.36,3.36) v1(24.36,6.36) v1(24.36,3.36) v1(26.86,16.59) v1(27.36,3.36) v1(30.92,7.76) v1(32.86,15.56) v1(34.22,10.03) v1(34.79,15.73) v1(35.86,15.56) v1(37.22,10.03) v1(37.22,7.03) v1(40.22,10.03) v1(43.22,10.03) v1(43.77,15.94) v1(44.86,16.91) v1(46.22,10.03) v1(46.22,7.03) v1(52.22,7.03) v1(52.95,16.55) v1(53.86,16.55) v1(62.12,15.66) v1(62.86,16.2) v1(63.3,5.48) v1(65.19,3.27) v1(65.19,2.06) v1(66.09,11) v1(66.41,3.54) v1(70.22,16.03) v1(73.22,16.03) v1(75.03,11.55) v1(75.03,10.35) v1(75.54,5.02) v1(76.15,5.69) v1(76.41,1.45) v1(77.63,2.17) v1(78.36,13.01) v1(79.1,15.69) v1(80.13,5.02) v1(80.59,5.74) v1(81.92,15.48) v1(82.65,1.8) v1(82.65,0.8) v1(84.36,10.01) v1(84.65,1.8) v1(84.65,0.8) v1(87.98,11.6) v1(88.7,15.83) v1(89.86,16.55) v1(91.32,5.06) v1(91.32,1.66) v1(93.32,5.06) v1(93.32,1.66) v1(95.07,11.6) v1(95.32,5.06) v1(95.32,1.66) v1(98.34,15.58) v1(98.86,17.02) v1(103.11,11.6) v1(104.86,15.56) v1(105.38,2.68) v1(107.42,15.66) v1(113.4,2.47) v1(113.86,15.57) v1(114.36,3.36) v1(116.33,16.05) v1(116.86,15.57) v1(117.36,9.36) v1(117.36,3.36) v1(120.36,9.36) v1(120.36,3.36) v1(122.16,1.81) v1(123.05,9.36) v1(123.36,3.36) v1(124.81,15.38) v1(125.86,16.91) v1(126.36,9.36) v1(126.36,3.36) v1(129.36,9.36) v1(129.36,3.36) v1(132.36,6.36) v1(132.36,3.36) v1(132.61,2.22) v1(134.16,15.08) v1(135.36,9.36) v1(135.36,6.36) v1(135.36,3.36) v1(138.36,12.36) v1(138.36,9.36) v1(138.36,6.36)
VCC: length 164.6
  Top Layer w0.5: H1.4 77.51,4.51 C2.2 77.51,5.72 78.21,6.42 U17.3 79.8,6.99 80.54,7.72 80.54,8.43 ; v1(80.54,12.62) 80.54,8.43 ; 80.54,8.43 83.29,8.43 84.15,7.57 CN1.3
  Bottom Layer w0.4: 71.54,19.45 80.54,19.45 ; 71.54,19.45 R12.1 ; 71.54,19.45 62.54,19.45 ; 80.54,19.45 89.54,19.45 ; 80.54,19.45 R17.1 80.54,12.62 v1(80.54,12.62) ; R26.1 125.54,19.45 ; 125.54,19.45 116.54,19.45 ; 125.54,19.45 128.73,19.45 130.42,17.77 132.24,17.77 R27.1 R28.1 ; 89.54,19.45 98.54,19.45 ; 89.54,19.45 R18.1 ; 116.54,19.45 R25.1 ; 116.54,19.45 107.54,19.45 ; 98.54,19.45 107.54,19.45 ; 98.54,19.45 R19.1 ; R9.1 44.54,19.45 ; 44.54,19.45 53.54,19.45 ; 44.54,19.45 35.54,19.45 ; 53.54,19.45 62.54,19.45 ; 53.54,19.45 R10.1 ; 62.54,19.45 R11.1 ; R4.1 35.54,19.45 ; 35.54,19.45 26.54,19.45 ; R3.1 26.54,19.45 ; 26.54,19.45 17.54,19.45 ; 107.54,19.45 R20.1 ; 17.54,19.45 9.34,19.45 R1.1 ; 17.54,19.45 R2.1
A0: length 50.8
  Bottom Layer w0.254: U18.2 50.6,12.17 49.82,12.95 6.07,12.95 R5.1 5.27,16.25 U1.3
A1: length 43
  Bottom Layer w0.254: U2.3 14.27,16.33 R6.1 14.8,13.3 50.69,13.3 51.87,12.12 U18.3
A2: length 35.3
  Bottom Layer w0.254: U3.3 23.27,16.33 R7.1 23.44,13.66 51.61,13.66 53.14,12.12 U18.4
A3: length 27.8
  Bottom Layer w0.254: U4.3 32.27,16.33 R8.1 32.09,14.01 52.63,14.01 54.36,12.28 54.36,11.25
A4: length 20.1
  Bottom Layer w0.254: 40.02,15.03 R13.1 ; 40.02,15.03 40.68,14.37 53.49,14.37 55.68,12.19 55.68,11.3 ; 40.02,15.03 41.27,16.28 U5.3
A5: length 12.2
  Bottom Layer w0.254: U18.7 56.95,12.24 54.11,15.08 R14.1 50.27,16.33 U6.3
A6: length 6
  Bottom Layer w0.254: U7.3 59.27,16.33 R15.1 58.22,14.88 U18.8
A7: length 11.8
  Bottom Layer w0.254: U8.3 68.27,16.33 R16.1 66.97,15.03 66.79,15.03 65.41,13.64 60.85,13.64 59.49,12.28 U18.9
A8: length 36.7
  Bottom Layer w0.254: U18.23 50.6,2.78 56.88,9.06 75.14,9.06 76.07,9.99 76.07,15.13 ; 76.07,15.13 77.27,16.33 U9.3 ; 76.07,15.13 R21.1
A9: length 41.5
  Bottom Layer w0.254: U10.3 86.27,16.33 R22.1 84.97,15.08 78.59,8.7 57.8,8.7 51.87,2.77 51.87,1.81
A10: length 49.1
  Bottom Layer w0.254: U18.21 53.14,2.77 58.72,8.35 87.29,8.35 R23.1 95.27,16.33 U11.3
A11: length 56.8
  Bottom Layer w0.254: U18.20 54.41,2.76 59.64,7.99 95.93,7.99 R24.1 104.27,16.33 U12.3
A12: length 64.6
  Bottom Layer w0.254: U18.19 55.68,2.81 60.51,7.64 104.58,7.64 R29.1 113.27,16.33 U13.3
A13: length 72.3
  Bottom Layer w0.254: U18.18 56.95,2.8 61.43,7.28 113.27,7.28 121.02,15.03 R30.1 122.27,16.33 U14.3
A14: length 80.1
  Bottom Layer w0.254: U15.3 131.27,16.33 R31.1 121.86,6.92 62.19,6.92 58.22,2.95 U18.17
A15: length 87.9
  Bottom Layer w0.254: U16.3 140.27,16.33 R32.1 138.87,15.08 130.35,6.57 62.91,6.57 59.49,3.15 U18.16
ADC_IN0: length 26.3
  Bottom Layer w0.254: U18.1 49.33,10.63 50.54,9.42 63.48,9.42 66.63,12.57 70.5,12.57 71.38,11.69 U19.6
D_CK: length 89
  Top Layer w0.254: v1(73.44,3.6) 72.34,4.7 45.26,4.7 43.05,6.91 40.96,6.91 37.23,3.19 31.12,3.19 29.01,5.3 U20.11 ; U21.11 108.72,5.61 v1(107.72,4.61)
  Bottom Layer w0.254: v1(107.72,4.61) 105.48,4.61 101.96,1.09 99.46,1.09 97.05,3.5 73.54,3.5 v1(73.44,3.6) 73.33,3.71 U19.12
L_CK: length 88.7
  Top Layer w0.254: v1(108.46,4.03) 109.99,5.56 U21.12 ; v1(39.55,6.33) 36.76,3.54 31.89,3.54 30.28,5.15 U20.12 ; v1(72.68,3.49) 71.83,4.35 45.11,4.35 43.15,6.31 v1(41.18,6.31)
  Bottom Layer w0.254: v1(41.18,6.31) 41.16,6.33 v1(39.55,6.33) ; v1(108.46,4.03) 105.18,0.74 99.05,0.74 96.78,3.01 73.2,3.01 72.72,3.49 v1(72.68,3.49) 72.68,4.65
LED1: length 34.5
  Top Layer w0.254: U20.15 34.09,6.9 31.88,9.1 8.27,9.1 R34.2
LED2: length 16.9
  Top Layer w0.254: U20.7 27.74,12.38 26.69,13.42 12.95,13.42 R35.2
LED3: length 9.2
  Top Layer w0.254: R36.2 27.34,14.11 29.01,12.44 U20.6
LED4: length 2.4
  Top Layer w0.254: U20.5 30.27,11.73 R37.2
LED5: length 9
  Top Layer w0.254: R38.2 33.37,14.11 31.55,12.29 U20.4
LED6: length 16.8
  Top Layer w0.254: R39.2 47.58,13.42 33.86,13.42 32.82,12.38 U20.3
LED7: length 24.6
  Top Layer w0.254: U20.2 34.09,12.48 34.68,13.07 56.23,13.07 R40.2
LED8: length 32.3
  Top Layer w0.254: U20.1 35.36,12.37 35.7,12.71 64.87,12.71 R41.2
LED9: length 42
  Top Layer w0.254: U21.15 113.8,6.44 109.83,10.42 86.56,10.42 82.88,14.11 R42.2
LED10: length 24.6
  Top Layer w0.254: U21.7 107.45,12.38 106.76,13.07 85.31,13.07 R43.2
LED11: length 16.8
  Top Layer w0.254: R44.2 93.95,13.42 107.63,13.42 108.72,12.33 U21.6
LED12: length 9.1
  Top Layer w0.254: U21.5 109.99,12.29 108.17,14.11 R45.2
LED13: length 2.4
  Top Layer w0.254: R46.2 111.27,11.72 U21.4
LED14: length 9.1
  Top Layer w0.254: U21.3 112.53,12.33 114.31,14.11 R47.2
LED15: length 16.8
  Top Layer w0.254: U21.2 113.8,12.33 114.9,13.42 128.58,13.42 R48.1
LED16: length 24.2
  Top Layer w0.254: R49.2 137.23,13.07 116.43,13.07 U21.1
LEDS: length 45
  Top Layer w0.254: U20.14 32.82,5.62 v1(33.36,5.07)
  Bottom Layer w0.254: v1(33.36,5.07) 37.95,0.48 70.24,0.48 70.85,1.09 70.85,1.98 72.03,3.17 U19.14
MUX_0: length 15.4
  Bottom Layer w0.254: U19.7 72.08,10.44 72.08,11.5 70.65,12.93 66.49,12.93 63.53,9.98 61.41,9.98 60.76,10.62 U18.10
MUX_1: length 13.6
  Bottom Layer w0.254: U19.8 72.68,11.4 72.64,11.44 ; U18.11 62.03,12.11 63.2,13.28 70.8,13.28 72.64,11.45
MUX_2: length 18.4
  Top Layer w0.254: 66.75,8.01 66.75,5.92 v1(66.8,5.87) ; v1(73.22,11.69) 73.18,11.69 72.33,10.84 69.57,10.84 66.75,8.01
  Bottom Layer w0.254: v1(73.22,11.69) 73.33,11.57 U19.9 ; v1(66.8,5.87) 65.11,5.87 62.03,2.79 U18.14
MUX_3: length 18.1
  Top Layer w0.254: v1(67.38,5.29) 67.38,8.14 69.72,10.48 72.84,10.48 73.94,11.58 v1(73.98,11.58)
  Bottom Layer w0.254: 73.98,11.58 U19.10 ; U18.13 63.3,2.88 65.71,5.29 v1(67.38,5.29)
SCL: length 18.5
  Top Layer w0.254: R51.1 81.97,6.3 82.15,6.11 CN1.1 81.96,5.17 v1(79.21,2.43) ; v1(70.58,2.54) 71.46,1.66 H1.3
  Bottom Layer w0.254: U19.17 70.08,3.03 v1(70.58,2.54) ; H1.3 73.25,0.53 77.31,0.53 v1(79.21,2.43)
SDA: length 21.1
  Top Layer w0.254: v1(82.78,4.08) 82.78,4.36 83.15,4.73 CN1.2 83.15,6.1 83.29,6.25 R52.1 ; v1(75.23,4.08) 73.94,2.78 71.39,2.78 71.06,3.12 70.22,3.12 69.58,2.48 H1.2
  Bottom Layer w0.254: H1.2 69.43,1.8 U19.18 ; 75.24,4.08 v1(82.78,4.08)
$1N608: length 1.8
  Bottom Layer w0.254: R1.2 U1.2
$1N2685: length 1.8
  Bottom Layer w0.254: U2.2 R2.2
$1N2871: length 1.8
  Bottom Layer w0.254: U3.2 R3.2
$1N3057: length 1.8
  Bottom Layer w0.254: U4.2 R4.2
$1N3755: length 1.8
  Bottom Layer w0.254: U6.2 R10.2
$1N3774: length 1.8
  Bottom Layer w0.254: U7.2 R11.2
$1N3775: length 1.8
  Bottom Layer w0.254: U5.2 R9.2
$1N3782: length 1.8
  Bottom Layer w0.254: U8.2 R12.2
$1N5185: length 1.8
  Bottom Layer w0.254: U13.2 R25.2
$1N5188: length 1.8
  Bottom Layer w0.254: U14.2 R26.2
$1N5208: length 6.2
  Bottom Layer w0.254: R28.2 135.16,19.13 135.16,19.17 135.32,19.33 139.59,19.33 U16.2
$1N5210: length 1.6
  Bottom Layer w0.254: U15.2 132.87,18.65 R27.2
$1N5219: length 1.8
  Bottom Layer w0.254: U10.2 R18.2
$1N5238: length 1.8
  Bottom Layer w0.254: U11.2 R19.2
$1N5239: length 1.8
  Bottom Layer w0.254: U9.2 R17.2
$1N5244: length 1.8
  Bottom Layer w0.254: U12.2 R20.2
$2N3092: length 93.1
  Top Layer w0.254: U20.9 26.47,5.69 31.64,0.53 78.18,0.53 80.28,2.62 87.83,2.62 89.93,0.53 107.46,0.53 112.53,5.6 U21.14
$2N3378: length 1.4
  Top Layer w0.254: R33.1 70.66,5.62 LED1.1
$2N3386: length 3.2
  Top Layer w0.254: R33.2 74.27,5.62 v1(74.28,5.6)
  Bottom Layer w0.254: v1(74.28,5.6) 73.98,5.31 U19.11
$2N3948: length 10.4
  Top Layer w0.254: JP1.1 62,10.17 66.32,10.17 v1(67.69,11.55)
  Bottom Layer w0.254: v1(67.69,11.55) 68.31,11.55 68.78,11.08 U19.2
$2N3976: length 9.2
  Top Layer w0.254: JP2.1 63.89,9.82 66.78,9.82 v1(68.83,11.86)
  Bottom Layer w0.254: v1(68.83,11.86) 69.35,11.34 69.43,11.34 69.43,11.34 U19.3
$2N7229: length 4.1
  Top Layer w0.254: C3.2 70.16,13.14 R50.1 70.09,13.07 v1(70.09,11.83)
  Bottom Layer w0.254: U19.4 70.08,11.83 v1(70.09,11.83)
$2N8629: length 5.6
  Top Layer w0.254: v1(68.83,5.96) 68.83,7 70.45,8.62 SWD.1
  Bottom Layer w0.254: v1(68.83,5.96) 68.78,5.91 U19.19
$2N8633: length 4.4
  Top Layer w0.254: CLK.1 68.14,7.61 v1(68.14,5.57)
  Bottom Layer w0.254: v1(68.14,5.57) 68.13,5.56 U19.20
$2N11480: length 1.3
  Top Layer w0.254: R38.1 LED6.1
$2N11482: length 1.3
  Top Layer w0.254: R35.1 LED3.1
$2N11483: length 1.3
  Top Layer w0.254: R40.1 LED8.1
$2N11484: length 1.3
  Top Layer w0.254: R39.1 LED7.1
$2N11485: length 1.3
  Top Layer w0.254: R42.1 LED10.1
$2N11486: length 1.3
  Top Layer w0.254: R43.1 LED11.1
$2N11487: length 1.3
  Top Layer w0.254: R41.1 LED9.1
$2N11490: length 1.3
  Top Layer w0.254: R44.1 LED12.1
$2N11491: length 1.3
  Top Layer w0.254: R45.1 LED13.1
$2N11503: length 1.3
  Top Layer w0.254: R46.1 LED14.1
$2N11504: length 1.3
  Top Layer w0.254: R47.1 LED15.1
$2N11507: length 1.3
  Top Layer w0.254: R36.1 LED4.1
$2N11508: length 1.3
  Top Layer w0.254: R34.1 LED2.1
$2N11509: length 1.3
  Top Layer w0.254: R37.1 LED5.1
$2N13226: length 1.3
  Top Layer w0.254: R48.2 LED16.1
$2N13360: length 1.3
  Top Layer w0.254: R49.1 LED17.1
$2N18356: length 3.5
  Top Layer w0.254: v1(67.63,9.72) 67.37,9.46 65.97,9.46 R53.2
  Bottom Layer w0.254: U19.1 68.13,10.22 v1(67.63,9.72)

## Copper pours and planes (outline as drawn; the poured copper is in the pictures)
GND on Top Layer: -5.45,31.29 150.36,31.29 150.36,-10.74 -5.45,-10.74
GND on Bottom Layer: -5.45,31.29 150.36,31.29 150.36,-10.74 -5.45,-10.74

Small or netless copper shapes (teardrops, artwork), in the pictures only: 188 on Top Layer, 232 on Bottom Layer

## Text on the board
Bottom Silkscreen Layer: v0.1.0 | MK_IR_I2C
Top Silkscreen Layer: S1 | S2 | 0x50|(S2<<1)|S1 | GND | SDA | SCL | VCC | v0.1.0 | MK_IR_I2C
